# EAGLE design MN12832JC-TeensyLC (EAGLE 9.5.1)
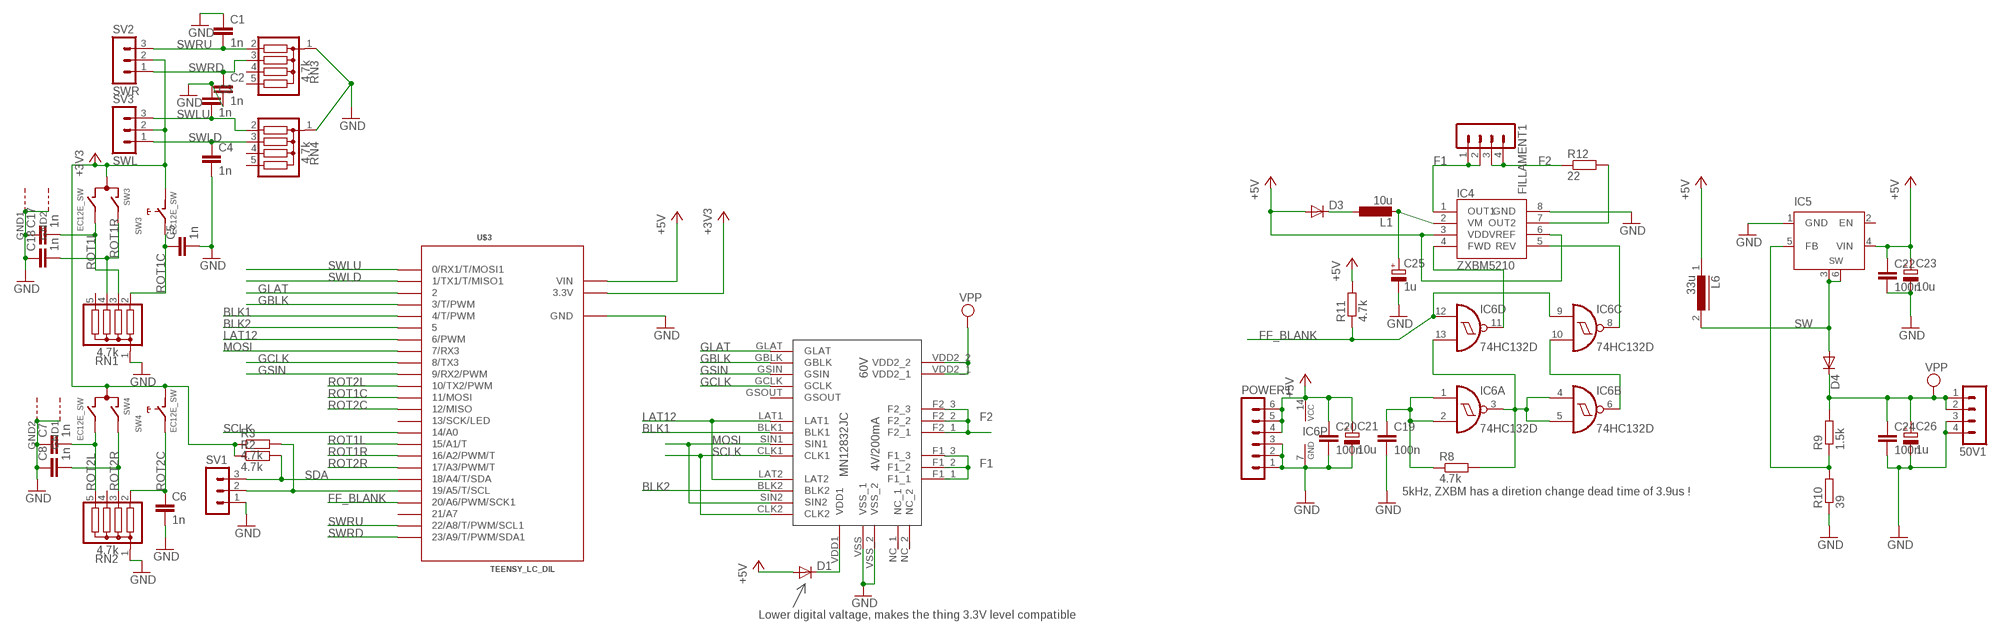
[diagram p0: schematic, sheet 1]

## Parts
50V1  MA04-1  [MA04-1]
C1  1n  C-EUC1206  [C1206]
C2  1n  C-EUC1206  [C1206]
C3  1n  C-EUC1206  [C1206]
C4  1n  C-EUC1206  [C1206]
C5  1n  C-EUC1206  [C1206]
C6  1n  C-EUC1206  [C1206]
C7  1n  C-EUC1206  [C1206]
C8  1n  C-EUC1206  [C1206]
C17  1n  C-EUC1206  [C1206]
C18  1n  C-EUC1206  [C1206]
C19  100n  C-EUC1206  [C1206]
C20  100n  C-EUC1206  [C1206]
C21  10u  CPOL-EU153CLV-0807  [153CLV-0807]
C22  100n  C-EUC1206  [C1206]
C23  10u  CPOL-EU153CLV-0807  [153CLV-0807]
C24  100n  C-EUC1206  [C1206]
C25  1u  CPOL-EU153CLV-0505  [153CLV-0505]
C26  1u  CPOL-EU153CLV-0505  [153CLV-0505]
D1  DIODE-SMB  [SMB]
D3  DIODE-SMB  [SMB]
D4  DIODE-SMB  [SMB]
FILLAMENT1  MA04-1  [MA04-1]
IC4  ZXBM5210  [SO8]
IC5  XL6009  [TO263-5]
IC6  74HC132D  [SO14]
L1  10u  L-EUL1812  [L1812]
L6  33u  DR125  [DR125]
POWER1  MA06-1  [MA06-1]
R2  4.7k  R-EU_R1206  [R1206]
R3  4.7k  R-EU_R1206  [R1206]
R8  4.7k  R-EU_R1206  [R1206]
R9  1.5k  R-EU_R1206  [R1206]
R10  39  R-EU_R1206  [R1206]
R11  4.7k  R-EU_R1206  [R1206]
R12  22  R-EU_0411/15  [0411/15]
RN1  4.7k  G04R  [SIL5]
RN2  4.7k  G04R  [SIL5]
RN3  4.7k  G04R  [SIL5]
RN4  4.7k  G04R  [SIL5]
SV1  MA03-1  [MA03-1]
SV2  SWR  MA03-1  [MA03-1]
SV3  SWL  MA03-1  [MA03-1]
SW3  EC12E_SW  [ALPS_EC12E_SW]
SW4  EC12E_SW  [ALPS_EC12E_SW]
U$1  MN12832JC  [MN12832JC]
U$3  TEENSY_LC_DIL  [TEENSY_3.0-3.2&LC_DIL]

## Nets
+3V3 [w24]: R2.1 R3.1 SV2.2 SV3.2 SW3.C SW3.D SW4.C SW4.D U$3.3.3V
+5V [+5V]: C20.1 C21.+ C22.1 C23.+ D1.A D3.A IC4.3(VDD) IC4.6(VREF) IC5.4(VIN) IC6.14(P:VCC) L6.1 POWER1.4 POWER1.5 POWER1.6 R11.2 U$3.VIN
BLK1: U$1.BLK1 U$3.4(4/T/PWM)
BLK2: U$1.BLK2 U$3.5
F1 [w24]: FILLAMENT1.1 FILLAMENT1.2 IC4.1(OUT1) U$1.F1_1 U$1.F1_2 U$1.F1_3
F2 [w24]: FILLAMENT1.3 FILLAMENT1.4 R12.1 U$1.F2_1 U$1.F2_2 U$1.F2_3
FF_BLANK: IC6.9(C:I0) IC6.12(D:I0) R11.1 U$3.20/A6(20/A6/PWM/SCK1)
GBLK: U$1.GBLK U$3.3(3/T/PWM)
GCLK: U$1.GCLK U$3.8(8/TX3)
GLAT: U$1.GLAT U$3.2
GND: 50V1.3 50V1.4 C1.1 C2.2 C3.1 C4.2 C5.2 C6.2 C7.1 C8.1 C17.1 C18.1 C19.2 C20.2 C21.- C22.2 C23.- C24.2 C25.- C26.- IC4.8(GND) IC5.1(GND) IC6.7(P:GND) POWER1.1 POWER1.2 POWER1.3 R10.1 RN1.1 RN2.1 RN3.1 RN4.1 SV1.1 SW3.GND1(G) SW3.GND2(G) SW4.GND1(G) SW4.GND2(G) U$1.VSS(VSS_1) U$1.VSS_2 U$3.AGND(GND) U$3.GND
GSIN: U$1.GSIN U$3.9(9/RX2/PWM)
LAT12: U$1.LAT1 U$1.LAT2 U$3.6(6/PWM)
MOSI: U$1.SIN1 U$1.SIN2 U$3.7(7/RX3)
N$3 [+5V]: D1.C U$1.VDD1
N$13: C19.1 IC6.1(A:I0) IC6.2(A:I1) R8.1
N$15: IC4.5(REV) IC6.8(C:O)
N$16 [w24]: D3.C L1.1
N$17 [w24]: C25.+ IC4.2(VM) L1.2
N$18: IC6.3(A:O) IC6.4(B:I0) IC6.5(B:I1) IC6.13(D:I1) R8.2
N$19: IC5.5(FB) R9.1 R10.2
N$20: IC6.6(B:O) IC6.10(C:I1)
N$21: IC4.4(FWD) IC6.11(D:O)
N$22 [w24]: IC4.7(OUT2) R12.2
ROT1C: C5.1 RN1.2 SW3.E U$3.11(11/MOSI)
ROT1L: C17.2 RN1.3 SW3.B U$3.15/A1(15/A1/T)
ROT1R: C18.2 RN1.4 SW3.A U$3.16/A2(16/A2/PWM/T)
ROT2C: C6.1 RN2.2 SW4.E U$3.12(12/MISO)
ROT2L: C7.2 RN2.5 SW4.B U$3.10(10/TX2/PWM)
ROT2R: C8.2 RN2.3 SW4.A U$3.17/A3(17/A3/PWM/T)
SCL: R3.2 SV1.2 U$3.19/A5(19/A5/T/SCL)
SCLK: U$1.CLK1 U$1.CLK2 U$3.14/A0
SDA: R2.2 SV1.3 U$3.18/A4(18/A4/T/SDA)
SW: D4.A IC5.3(SW) IC5.6(SW) L6.2
SWLD: C4.1 RN4.3 SV3.1 U$3.1(1/TX1/T/MISO1)
SWLU: C3.2 RN4.2 SV3.3 U$3.0(0/RX1/T/MOSI1)
SWRD: C2.1 RN3.3 SV2.1 U$3.23/A9(23/A9/T/PWM/SDA1)
SWRU: C1.2 RN3.2 SV2.3 U$3.22/A8(22/A8/T/PWM/SCL1)
VPP [w24]: 50V1.1 50V1.2 C24.1 C26.+ D4.C R9.2 U$1.VDD2_1 U$1.VDD2_2
Unconnected: IC5.2(EN) RN1.5 RN2.4 RN3.4 RN3.5 RN4.4 RN4.5 U$1.GSOUT U$1.NC_1 U$1.NC_2 U$3.13(13/SCK/LED) U$3.21/A7

## Notes on the sheet
- 5kHz, ZXBM has a diretion change dead time of 3.9us !
- Lower digital valtage, makes the thing 3.3V level compatible

## Library data of the parts
50V1 FILLAMENT1 = con-lstb:MA04-1: PIN HEADER; OC_FARNELL: unknown; OC_NEWARK: unknown
C1-C8 C17-C20 C22 C24 = rcl:C-EU: CAPACITOR, European symbol; SPICEPREFIX: C
C21 C23 C25 C26 = rcl:CPOL-EU: POLARIZED CAPACITOR, European symbol; SPICEPREFIX: C
D1 D3 D4 = diode:DIODE-: DIODE
IC4 = vfds:ZXBM5210: H-Bridge motor driver.; PARTNAME: ZXBM5210
IC5 = vfds:XL6009: STEP-DOWN VOLTAGE REGULATOR
IC6 = 74xx-eu:74*132: Quad 2-input NAND schmitt trigger
L1 = rcl:L-EU: INDUCTOR, European symbol; SPICEPREFIX: L
L6 = inductors:DR125: High Power Density, High Efficiency, Shielded Inductors Source: coiltronics_dr_series.pdf; SPICEPREFIX: L
POWER1 = con-lstb:MA06-1: PIN HEADER; OC_FARNELL: unknown; OC_NEWARK: unknown
R2 R3 R8-R12 = rcl:R-EU_: RESISTOR, European symbol; SPICEPREFIX: R
RN1-RN4 = resistor-sil:G04R: SIL RESISTOR; OC_FARNELL: unknown; OC_NEWARK: unknown
SV1-SV3 = con-lstb:MA03-1: PIN HEADER; OC_FARNELL: unknown; OC_NEWARK: unknown
SW3 SW4 = vfds:EC12E_SW: ALPS rotary Encoder EC12E series with switch; MPN: EC12E2424407; OC_FARNELL: 1520813; OC_NEWARK: 74M1068
U$1 = vfds:MN12832JC
U$3 = Teensy_3_and_LC_Series_Boards_v1.4:TEENSY_LC_DIL

## Net classes
1 +5V: width 0.813 mm, clearance 0.508 mm
2 w24: width 0.61 mm

## Board
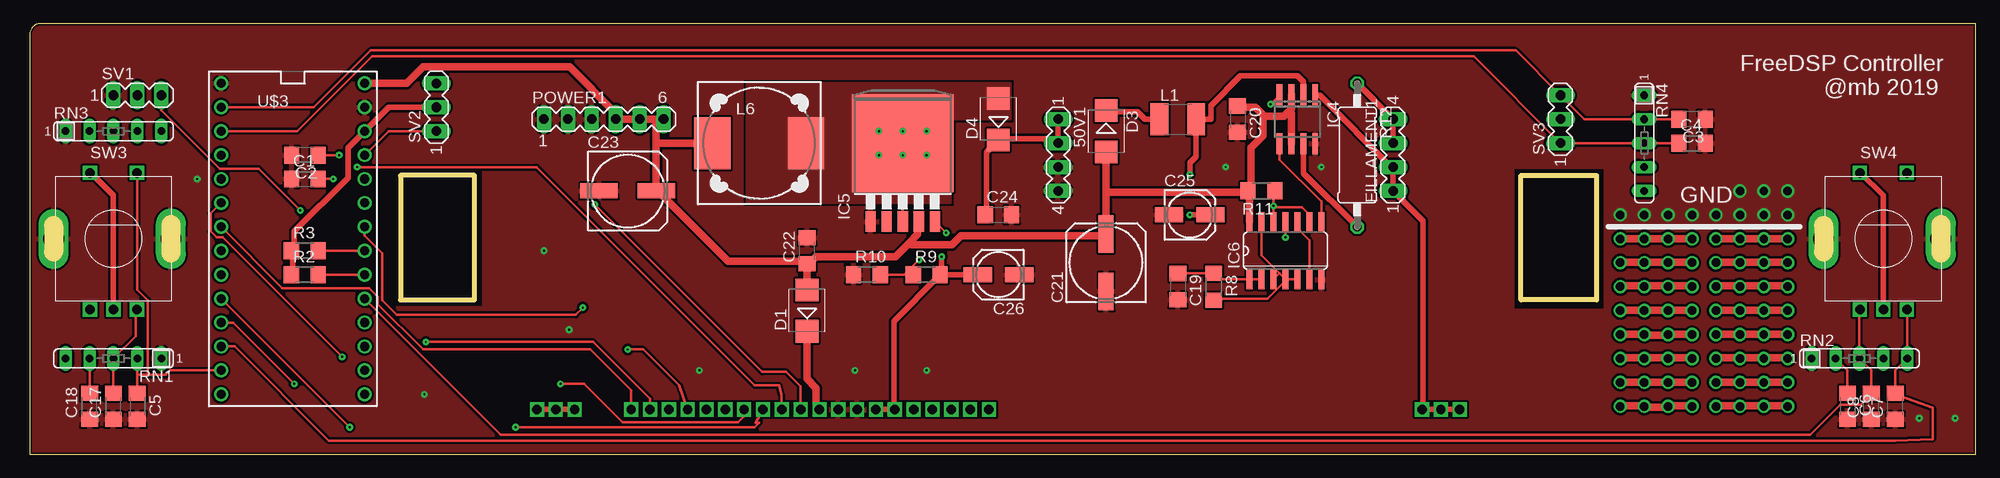
[diagram p1: board, top side]
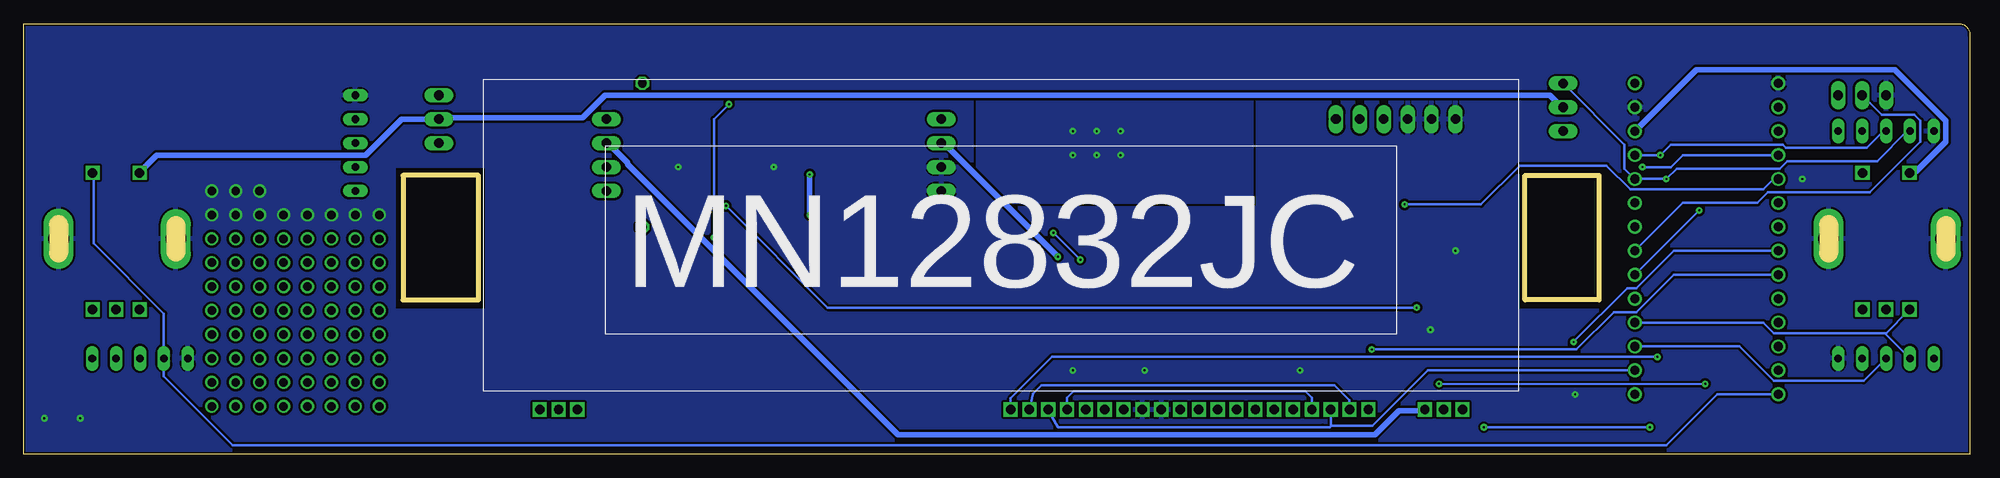
[diagram p2: board, bottom side, seen from below]

Size 206.68 x 45.71 mm. Coordinates in mm from the lower left corner, seen from the top.
Outline: 0,0 206.68,0 206.68,45.71 1.26,45.71 arc100 0,44.45 0,0
Copper layers (1*16): Top 0.07mm / dielectric 1.5mm / Bottom 0.07mm
Design rules "Multi-CB_2L_250um-Tracks_OL105um": minimum track width 0.25mm, minimum drill 0.2mm, track to track 0.25mm, track to pad 0.25mm, pad to pad 0.25mm, via to via 0.25mm, smd to smd 0mil, copper to edge 0.2mm, drill to drill 0.2mm, minimum pad ring 0.25mm, minimum via ring 0.25mm, stop-mask expansion 2mil, vias tented up to drill 0.45mm, thermal gap 0.2mm
tKeepout: area 158.2,16.1 to 166.5,29.7; area 39.2,16.1 to 47.5,29.7
bKeepout: area 158.2,16.1 to 166.5,29.7; area 39.2,16.1 to 47.5,29.7
tRestrict: area 38.7,15.7 to 48,30.2; area 157.7,15.5 to 167.1,30.2
bRestrict: area 38.7,15.5 to 47.8,30.5; area 157.7,15.5 to 167.1,30.4
Milling: 8 lines

### Footprints (pad centres in the part's own frame; a part is rotated, then mirrored left to right if it is on the bottom)
MA04-1 = drill 1.016 long: 1 -3.81,0; 2 -1.27,0; 3 1.27,0; 4 3.81,0
C1206 = smd 1.6 x 1.8: 1 -1.4,0; 2 1.4,0
153CLV-0807 = smd 4 x 1.6: + 3.05,0; - -3.05,0
153CLV-0505 = smd 3 x 1.6: + 2.2,0; - -2.2,0
SMB = smd 2.4 x 2.4: A 2.2,0; C -2.2,0
SO8 = smd 0.6 x 2.2: 1 -1.905,-2.6; 2 -0.635,-2.6; 3 0.635,-2.6; 4 1.905,-2.6; 5 1.905,2.6; 6 0.635,2.6; 7 -0.635,2.6; 8 -1.905,2.6
TO263-5 = smd 1.067 x 2.159: 1 -3.404,-5.791; 2 -1.702,-5.791; 3 0,-5.791; 4 1.702,-5.791; 5 3.404,-5.791 | smd 10.8 x 10.41: 6 0,2.54
SO14 = smd 0.66 x 2.032: 1 -3.81,-3.073; 2 -2.54,-3.073; 3 -1.27,-3.073; 4 0,-3.073; 5 1.27,-3.073; 6 2.54,-3.073; 7 3.81,-3.073; 8 3.81,3.073; 9 2.54,3.073; 10 1.27,3.073; 11 0,3.073; 12 -1.27,3.073; 13 -2.54,3.073; 14 -3.81,3.073
L1812 = smd 1.9 x 3.4: 1 -1.95,0; 2 1.95,0
DR125 = smd 3.85 x 5.5: 1 -4.975,0; 2 4.975,0
MA06-1 = drill 1.016 long: 1 -6.35,0; 2 -3.81,0; 3 -1.27,0; 4 1.27,0; 5 3.81,0; 6 6.35,0
R1206 = smd 1.6 x 1.803: 1 -1.422,0; 2 1.422,0
0411/15 = drill 0.914 octagon: 1 -7.62,0; 2 7.62,0
SIL5 = drill 0.813 long: 1 -5.08,0; 2 -2.54,0; 3 0,0; 4 2.54,0; 5 5.08,0
MA03-1 = drill 1.016 long: 1 -2.54,0; 2 0,0; 3 2.54,0
ALPS_EC12E_SW = drill 1 square: A -2.5,-7.5; B 2.5,-7.5; C 0,-7.5; D -2.5,7; E 2.5,7 | drill 2.2 long: GND1 -6.35,-0.004; GND2 6.096,0.004
MN12832JC = drill 1 square: BLK1 1.39,-17.24; BLK2 39.39,-17.24; CLK1 5.39,-17.24; CLK2 35.39,-17.24; F1_1 -48.61,-17.24; F1_2 -46.61,-17.24; F1_3 -44.61,-17.24; F2_1 45.39,-17.24; F2_2 47.39,-17.24; F2_3 49.39,-17.24; GBLK 21.39,-17.24; GCLK 25.39,-17.24; GLAT 23.39,-17.24; GSIN 27.39,-17.24; GSOUT 29.39,-17.24; LAT1 3.39,-17.24; LAT2 37.39,-17.24; NC_1 9.39,-17.24; NC_2 31.39,-17.24; SIN1 7.39,-17.24; SIN2 33.39,-17.24; VDD1 19.39,-17.24; VDD2_1 11.39,-17.24; VDD2_2 13.39,-17.24; VSS 15.39,-17.24; VSS_2 17.39,-17.24
TEENSY_3.0-3.2&LC_DIL = drill 0.965: 0 -7.62,13.97; 1 -7.62,11.43; 2 -7.62,8.89; 3 -7.62,6.35; 3.3V 7.62,11.43; 4 -7.62,3.81; 5 -7.62,1.27; 6 -7.62,-1.27; 7 -7.62,-3.81; 8 -7.62,-6.35; 9 -7.62,-8.89; 10 -7.62,-11.43; 11 -7.62,-13.97; 12 -7.62,-16.51; 13 7.62,-16.51; 14/A0 7.62,-13.97; 15/A1 7.62,-11.43; 16/A2 7.62,-8.89; 17/A3 7.62,-6.35; 18/A4 7.62,-3.81; 19/A5 7.62,-1.27; 20/A6 7.62,1.27; 21/A7 7.62,3.81; 22/A8 7.62,6.35; 23/A9 7.62,8.89; AGND 7.62,13.97; GND -7.62,16.51; VIN 7.62,16.51

### Placement (x,y rotation side)
50V1  109.22,31.75 270 top
C1  29.21,29.21 0 top
C2  29.21,31.75 180 top
C3  176.53,35.56 180 top
C4  176.53,33.02 0 top
C5  11.43,5.08 270 top
C6  193.04,5.08 270 top
C7  198.12,5.08 90 top
C8  195.58,5.08 90 top
C17  8.89,5.08 90 top
C18  6.35,5.08 90 top
C19  121.92,17.78 270 top
C20  128.27,35.56 270 top
C21  114.3,20.32 90 top
C22  82.55,21.59 90 top
C23  63.5,27.94 0 top
C24  102.87,25.4 0 top
C25  123.19,25.4 0 top
C26  102.87,19.05 180 top
D1  82.55,15.24 90 top
D3  114.3,34.29 270 top
D4  102.87,35.56 90 top
FILLAMENT1  144.78,31.75 90 top
IC4  134.62,35.56 180 top
IC5  92.71,30.48 0 top
IC6  133.35,21.59 0 top
L1  121.92,35.56 0 top
L6  77.47,33.02 0 top
POWER1  60.96,35.56 0 top
R2  29.21,19.05 0 top
R3  29.21,21.59 0 top
R8  125.73,17.78 270 top
R9  95.25,19.05 0 top
R10  88.9,19.05 0 top
R11  130.81,27.94 180 top
R12  140.97,31.75 270 top
RN1  8.89,10.16 180 top
RN2  194.31,10.16 0 top
RN3  8.89,34.29 0 top
RN4  171.45,33.02 270 top
SV1  11.43,38.1 0 top
SV2  43.18,36.83 90 top
SV3  162.56,35.56 90 top
SW3  8.89,22.86 0 top
SW4  196.85,22.86 0 top
U$1  103.26,21.97 0 bottom
U$3  27.94,22.86 0 top

### Tracks (layer width: path | path; a pad name or v marks a point on that pad's centre or on a via)
+3V3
  Top 0.61: SW4.C 196.85,27.46 194.47,29.84 SW4.D | SW3.C 8.89,27.46 6.51,29.84 SW3.D | R2.1 27.94,19.05 27.94,21.59 R3.1 28.1,21.75 28.1,23.65 33.82,29.37 33.82,32.54 U$3.3.3V 38.1,36.83 SV2.2
  Bottom 0.61: SW4.D 194.31,30 192.57,31.75 170.34,31.75 166.53,35.56 SV3.2 162.41,35.72 147.32,35.72 144.94,38.1 44.61,38.1 43.34,36.83 SV2.2 | U$3.3.3V 29.06,40.8 7.94,40.8 2.54,35.4 2.54,33.18 5.72,30 6.35,30 SW3.D
+5V
  Top 0.813: 114.3,27.78 C21.+ 113.99,23.18 98.91,23.18 97.95,22.23 93.67,22.23 93.43,22.46 | 114.3,27.78 D3.A | IC6.14 129.54,27.94 R11.2 | 131.13,35.88 130.18,36.83 128.27,36.83 C20.1 | 131.13,35.88 133.2,35.88 133.75,36.43 | 133.75,36.43 133.99,36.67 IC4.3 | IC4.6 133.99,36.2 133.75,36.43 | R11.2 129.7,28.26 129.7,32.54 130.97,33.81 130.97,35.56 131.13,35.88 | 114.3,27.78 129.07,27.78 R11.2 | 93.43,22.46 91.92,20.95 83.51,20.95 82.87,20.32 C22.1 | 93.43,22.46 94.3,23.34 94.3,24.61 IC5.4 | U$3.VIN 40.01,39.37 41.76,41.12 57.31,41.12 62.23,36.2 POWER1.4 POWER1.5 66.52,35.56 | 66.52,35.56 POWER1.6 | 66.52,35.56 66.52,33.02 | 66.52,33.02 66.52,27.94 C23.+ 66.84,27.78 74.14,20.48 82.24,20.48 C22.1 | 66.52,33.02 L6.1 | C22.1 D1.A
BLK1  (via drill 0.2)
  Top 0.25: v33.18,10.32 20.48,23.02 19.85,23.02 19.21,23.65 19.21,25.56 U$3.4
  Bottom 0.25: U$1.BLK1 101.87,5.93 97.48,10.32 v33.18,10.32
BLK2
  Top 0.25: U$1.BLK2 63.87,6.78 59.54,11.11 41.76,11.11 36.93,15.94 36.93,16.73 36.04,17.62 26.83,17.62 U$3.5
F1
  Top 0.61: U$1.F1_1 151.77,4.76 150.02,4.76 U$1.F1_2 149.86,4.76 147.96,4.76 U$1.F1_3 147.96,5.08 147.96,24.77 FILLAMENT1.1 FILLAMENT1.2 144.63,30.48 137.01,38.1 136.53,38.1 IC4.1
F2
  Top 0.61: U$1.F2_3 53.98,4.76 55.73,4.76 U$1.F2_2 56.04,4.76 57.79,4.76 U$1.F2_1 | R12.1 FILLAMENT1.4 FILLAMENT1.3
  Bottom 0.61: FILLAMENT1.3 144.63,33.02 142.56,30.96 142.56,30.8 113.83,2.06 63.16,2.06 60.62,4.6 57.95,4.6 U$1.F2_1
FF_BLANK  (via drill 0.2)
  Top 0.25: IC6.12 132.08,26.19 | 132.08,26.19 v132.08,26.35 132.08,27.94 R11.1 | IC6.9 135.89,25.4 135.1,26.19 132.08,26.19 | U$3.20/A6 35.56,23.18 37.44,21.3 37.44,16.35 38.99,14.8 57.98,14.8 v58.74,15.56
  Bottom 0.25: v58.74,15.56 121.29,15.56 v132.08,26.35
GBLK  (via drill 0.2)
  Top 0.25: U$1.GBLK 81.87,7.2 80.33,8.73 77.79,8.73 v60.01,26.51
  Bottom 0.25: v60.01,26.51 51.92,26.51 47.79,30.64 38.58,30.64 36.04,28.1 21.91,28.1 20.8,29.21 U$3.3
GCLK  (via drill 0.2)
  Top 0.25: v51.6,2.86 77,2.86 77.47,3.33 77.06,3.33 U$1.GCLK | U$3.8 v33.98,2.86
  Bottom 0.25: v33.98,2.86 v51.6,2.86
GLAT  (via drill 0.2)
  Top 0.25: v34.77,30.48 53.82,30.48 77,7.3 79.55,7.3 79.87,6.29 U$1.GLAT
  Bottom 0.25: v34.77,30.48 31.75,30.48 30.48,31.75 U$3.2
GND  (via drill 0.2, 0.9)
  other vias: 204.47,3.81 200.66,3.81 127,30.48 137.16,30.48 54.61,21.59 57.28,13.21 71.12,8.89 87.63,8.89 95.25,8.89 41.91,6.35 17.78,29.21 168.91,25.4 171.45,25.4 173.99,25.4 176.53,25.4 179.07,25.4 181.61,25.4 184.15,25.4 186.69,25.4 181.61,27.94 184.15,27.94 186.69,27.94
  pour Top (rank 6): -10.16,48.26 -10.16,-3.81 215.9,-3.81 215.9,48.26
  pour Bottom (rank 6): -17.78,50.8 -17.78,-6.35 223.52,-6.35 223.52,50.8
GSIN  (via drill 0.2)
  Top 0.25: U$1.GSIN 75.87,4.04 75.22,3.4 62.96,3.4 58.9,7.46 v56.36,7.46 | U$3.9 21.59,13.97 v28.1,7.46
  Bottom 0.25: v28.1,7.46 28.14,7.43 v56.36,7.46
LAT12  (via drill 0.2)
  Top 0.25: v42.07,11.91 59.85,11.91 65.87,5.89 U$1.LAT2
  Bottom 0.25: U$1.LAT2 65.87,5.7 67.47,7.3 98.59,7.3 99.48,6.41 U$1.LAT1 | U$3.6 31.44,21.59 35.41,17.62 36.36,17.62 v42.07,11.91
MOSI  (via drill 0.2)
  Top 0.25: v63.5,11.11 65.16,11.11 68.97,7.3 U$1.SIN2
  Bottom 0.25: U$1.SIN1 95.87,6 95.2,6.67 70.53,6.67 69.87,6 U$1.SIN2 | U$3.7 31.44,19.05 35.41,15.08 37.79,15.08 41.76,11.11 v63.5,11.11
N$3
  Top 0.813: D1.C 82.55,7.98 83.53,7 83.53,5.07 U$1.VDD1
N$13
  Top 0.25: 129.54,18.57 130.81,18.57 IC6.2 | C19.1 121.92,19.21 R8.1 125.73,19.05 126.21,18.57 129.54,18.57 | 129.54,18.57 IC6.1
N$15
  Top 0.25: IC6.8 137.16,26.83 132.72,31.27 IC4.5
N$16
  Top 0.61: D3.C 114.3,36.35 117.64,36.35 118.43,35.56 L1.1
N$17  (via drill 0.2)
  Top 0.254: 123.83,31.59 123.87,31.64
  Top 0.61: IC4.2 135.26,39.53 134.62,40.16 128.59,40.16 125.42,36.99 125.42,35.56 L1.2 123.87,31.64 | v123.19,25.4 C25.+ | v123.19,29.69 123.19,30.96 123.83,31.59
  Bottom 0.61: v123.19,29.69 v123.19,25.4
N$18
  Top 0.25: R8.2 125.73,16.51 131.45,16.51 133.35,18.41 IC6.4 133.35,18.57 | IC6.13 130.81,21.11 132.72,19.21 | 133.35,18.57 132.72,19.21 | 132.72,19.21 132.08,18.57 IC6.3 | 133.35,18.57 134.62,18.57 IC6.5
N$19  (via drill 0.2)
  Top 0.25: R9.1 92.87,19.05 | 92.87,19.05 R10.2 | v97.32,23.5 96.21,24.61 IC5.5 | 92.87,19.05 v94.46,20.64
  Bottom 0.25: v94.46,20.64 v97.32,23.5
N$20
  Top 0.25: IC6.6 135.89,22.7 134.62,23.97 IC6.10
N$21  (via drill 0.2)
  Top 0.25: v133.35,23.02 IC6.11 | v131.77,37.15 132.72,38.1 IC4.4
  Bottom 0.25: v133.35,23.02 133.35,35.56 v131.77,37.15
N$22
  Top 0.61: IC4.7 135.26,29.84 R12.2
ROT1C
  Top 0.25: RN1.2 11.43,8.41 | 11.43,8.41 C5.1 | U$3.11 14.93,8.89 14.45,8.41 12.55,8.41 | 11.43,8.41 12.55,8.41 | 12.55,8.41 12.55,16.35 11.43,17.46 11.43,29.84 SW3.E
ROT1L
  Top 0.25: C17.2 RN1.3 11.28,12.54 11.28,15.24 SW3.B
  Bottom 0.25: U$3.15/A1 24.45,11.43 20.8,7.78 11.28,7.78 RN1.3
ROT1R
  Top 0.25: RN1.4 C18.2
  Bottom 0.25: U$3.16/A2 21.91,13.97 20.8,12.86 9.05,12.86 | 9.05,12.86 8.89,12.86 6.51,15.24 SW3.A | 9.05,12.86 RN1.4
ROT2C
  Top 0.25: C6.1 193.04,8.89 RN2.2
  Bottom 0.25: U$3.12 26.83,6.35 32.23,0.95 184.47,0.95 191.77,8.26 RN2.2 191.77,14.92 199.24,22.38 199.24,29.84 SW4.E
ROT2L
  Top 0.25: U$3.10 21.75,11.43 31.75,1.43 198.12,1.43 202.09,1.59 202.09,4.92 198.12,6.35 C7.2 198.12,8.89 RN2.5 199.39,15.24 SW4.B
ROT2R
  Top 0.25: U$3.17/A3 50.01,2.06 189.08,2.06 192.25,5.24 194.47,5.24 195.58,6.35 C8.2 195.58,8.89 RN2.3 194.31,15.24 SW4.A
SCL
  Top 0.25: U$3.19/A5 R3.2
  Bottom 0.25: SV1.2 9.37,36.04 5.88,36.04 5.24,35.4 5.24,33.18 10.64,27.78 21.44,27.78 22.55,26.67 30.48,26.67 U$3.19/A5
SCLK
  Bottom 0.25: 68.74,2.86 96.82,2.86 U$1.CLK1 | U$3.14/A0 57.57,8.89 63.44,3.02 | 67.79,3.02 67.87,3.09
  Bottom 0.254: U$1.CLK2 67.87,3.09 | 63.44,3.02 67.79,3.02 67.95,2.86 68.74,2.86
SDA  (via drill 0.2)
  Top 0.25: U$3.18/A4 R2.2 | SV1.3 13.97,36.51 20.17,30.32 24.29,30.32 v28.74,25.88
  Bottom 0.25: U$3.18/A4 v28.74,25.88
SW  (via drill 0.2)
  Top 0.25: 92.71,26.67 IC5.3
  other vias: 92.71,34.29 90.17,34.29 95.25,34.29 95.25,31.75 92.71,31.75 90.17,31.75
  pour Bottom (no thermals): 76.2,39.37 105.41,39.37 105.41,26.67 76.2,26.67
  pour Top (no thermals): 76.2,39.37 76.2,26.67 97.79,26.67 97.79,35.56 104.14,35.56 104.14,39.37
SWLD
  Top 0.25: C4.1 RN4.3 SV3.1 153.36,42.23 36.36,42.23 28.42,34.29 U$3.1
SWLU
  Top 0.25: C3.2 RN4.2 165.1,35.56 SV3.3 157.8,42.86 36.2,42.86 30.17,36.83 U$3.0
SWRD  (via drill 0.2)
  Top 0.25: v32.87,31.75 C2.1 | SV2.1 38.1,34.29 U$3.23/A9
  Bottom 0.25: U$3.23/A9 v32.87,31.75 31.75,32.86 19.85,32.86 19.53,32.54 10.96,32.54 9.21,34.29 RN3.3
SWRU  (via drill 0.2)
  Top 0.25: v32.23,29.21 C1.2
  Bottom 0.25: RN3.2 6.67,34.29 9.85,31.11 19.37,31.11 20.17,30.32 31.12,30.32 v32.23,29.21 U$3.22/A8 36.68,30.32 36.68,32.86 SV2.3
VPP  (via drill 0.2)
  Top 0.61: 50V1.1 50V1.2 109.07,33.5 103.03,33.5 D4.C 102.87,33.34 101.6,32.07 101.6,25.4 C24.1 | U$1.VDD2_2 90.02,4.76 91.76,4.76 U$1.VDD2_1 91.76,5.08 91.76,14.13 96.52,18.89 R9.2 | C26.+ R9.2 | v96.84,20.95 96.84,19.21 R9.2
  Bottom 0.61: 50V1.2 108.91,33.02 v96.84,20.95
X1  (via drill 0.9)
  Top 0.813: v168.91,22.86 169,22.88 171.38,22.88 v171.45,22.86 171.75,22.88 173.88,22.88 v173.99,22.86 174.38,22.88 176.5,22.88 v176.53,22.86
X2  (via drill 0.9)
  Top 0.813: v168.91,20.32 169,20.38 171.38,20.38 v171.45,20.32 171.75,20.38 173.88,20.38 v173.99,20.32 174.38,20.38 176.5,20.38 v176.53,20.32
X3  (via drill 0.9)
  Top 0.813: v168.91,17.78 169,17.88 171.38,17.88 v171.45,17.78 171.75,17.88 173.88,17.88 v173.99,17.78 174.38,17.88 176.5,17.88 v176.53,17.78
X4  (via drill 0.9)
  Top 0.813: v168.91,15.24 169,15.25 171.38,15.25 v171.45,15.24 171.75,15.25 173.88,15.25 v173.99,15.24 174.38,15.25 176.5,15.25 v176.53,15.24
X5  (via drill 0.9)
  Top 0.813: v168.91,12.7 169,12.75 171.38,12.75 v171.45,12.7 171.88,12.62 173.88,12.62 v173.99,12.7 174.38,12.75 176.5,12.75 v176.53,12.7
X6  (via drill 0.9)
  Top 0.813: v168.91,10.16 169,10.25 171.38,10.25 v171.45,10.16 171.75,10.25 173.88,10.25 v173.99,10.16 174.38,10.25 176.5,10.25 v176.53,10.16
X7  (via drill 0.9)
  Top 0.813: v168.91,7.62 169,7.62 171.38,7.62 v171.45,7.62 171.75,7.62 173.88,7.62 v173.99,7.62 174.38,7.62 176.5,7.62 v176.53,7.62
X8  (via drill 0.9)
  Top 0.813: v168.91,5.08 169,5.12 171.38,5.12 v171.45,5.08 171.88,5 173.88,5 v173.99,5.08 174.38,5.12 176.5,5.12 v176.53,5.08
Y1  (via drill 0.9)
  Top 0.813: v179.07,22.86 179.13,22.88 181.5,22.88 v181.61,22.86 182,22.88 184.13,22.88 v184.15,22.86 184.5,22.88 186.63,22.88 v186.69,22.86
Y2  (via drill 0.9)
  Top 0.813: v179.07,20.32 179.13,20.38 181.5,20.38 v181.61,20.32 182,20.38 184.13,20.38 v184.15,20.32 184.5,20.38 186.63,20.38 v186.69,20.32
Y3  (via drill 0.9)
  Top 0.813: v179.07,17.78 179.13,17.88 181.5,17.88 v181.61,17.78 182,17.88 184.13,17.88 v184.15,17.78 184.5,17.88 186.63,17.88 v186.69,17.78
Y4  (via drill 0.9)
  Top 0.813: v179.07,15.24 179.13,15.25 181.5,15.25 v181.61,15.24 182,15.25 184.13,15.25 v184.15,15.24 184.5,15.25 186.63,15.25 v186.69,15.24
Y5  (via drill 0.9)
  Top 0.813: v179.07,12.7 179.13,12.75 181.5,12.75 v181.61,12.7 182,12.75 184.13,12.75 v184.15,12.7 184.5,12.75 186.63,12.75 v186.69,12.7
Y6  (via drill 0.9)
  Top 0.813: v179.07,10.16 179.13,10.25 181.5,10.25 v181.61,10.16 182,10.25 184.13,10.25 v184.15,10.16 184.5,10.25 186.63,10.25 v186.69,10.16
Y7  (via drill 0.9)
  Top 0.813: v179.07,7.62 179.13,7.62 181.5,7.62 v181.61,7.62 182,7.62 184.13,7.62 v184.15,7.62 184.5,7.62 186.63,7.62 v186.69,7.62
Y8  (via drill 0.9)
  Top 0.813: v179.07,5.08 179.13,5.12 181.5,5.12 v181.61,5.08 182,5.12 184.13,5.12 v184.15,5.08 184.5,5.12 186.63,5.12 v186.69,5.08

### Text on the board
tNames: FreeDSP Controller | @mb 2019 | GND